# Altium schematic sheet PonyProgFT.SchDoc: USB - Power - I/O
size A3; Author: Claudio Lanconelli; CompanyName: Eurek srl; DrawnBy: Claudio Lanconelli; Organization: Eurek srl; DocumentNumber: 1; SheetNumber: 1; SheetTotal: 1
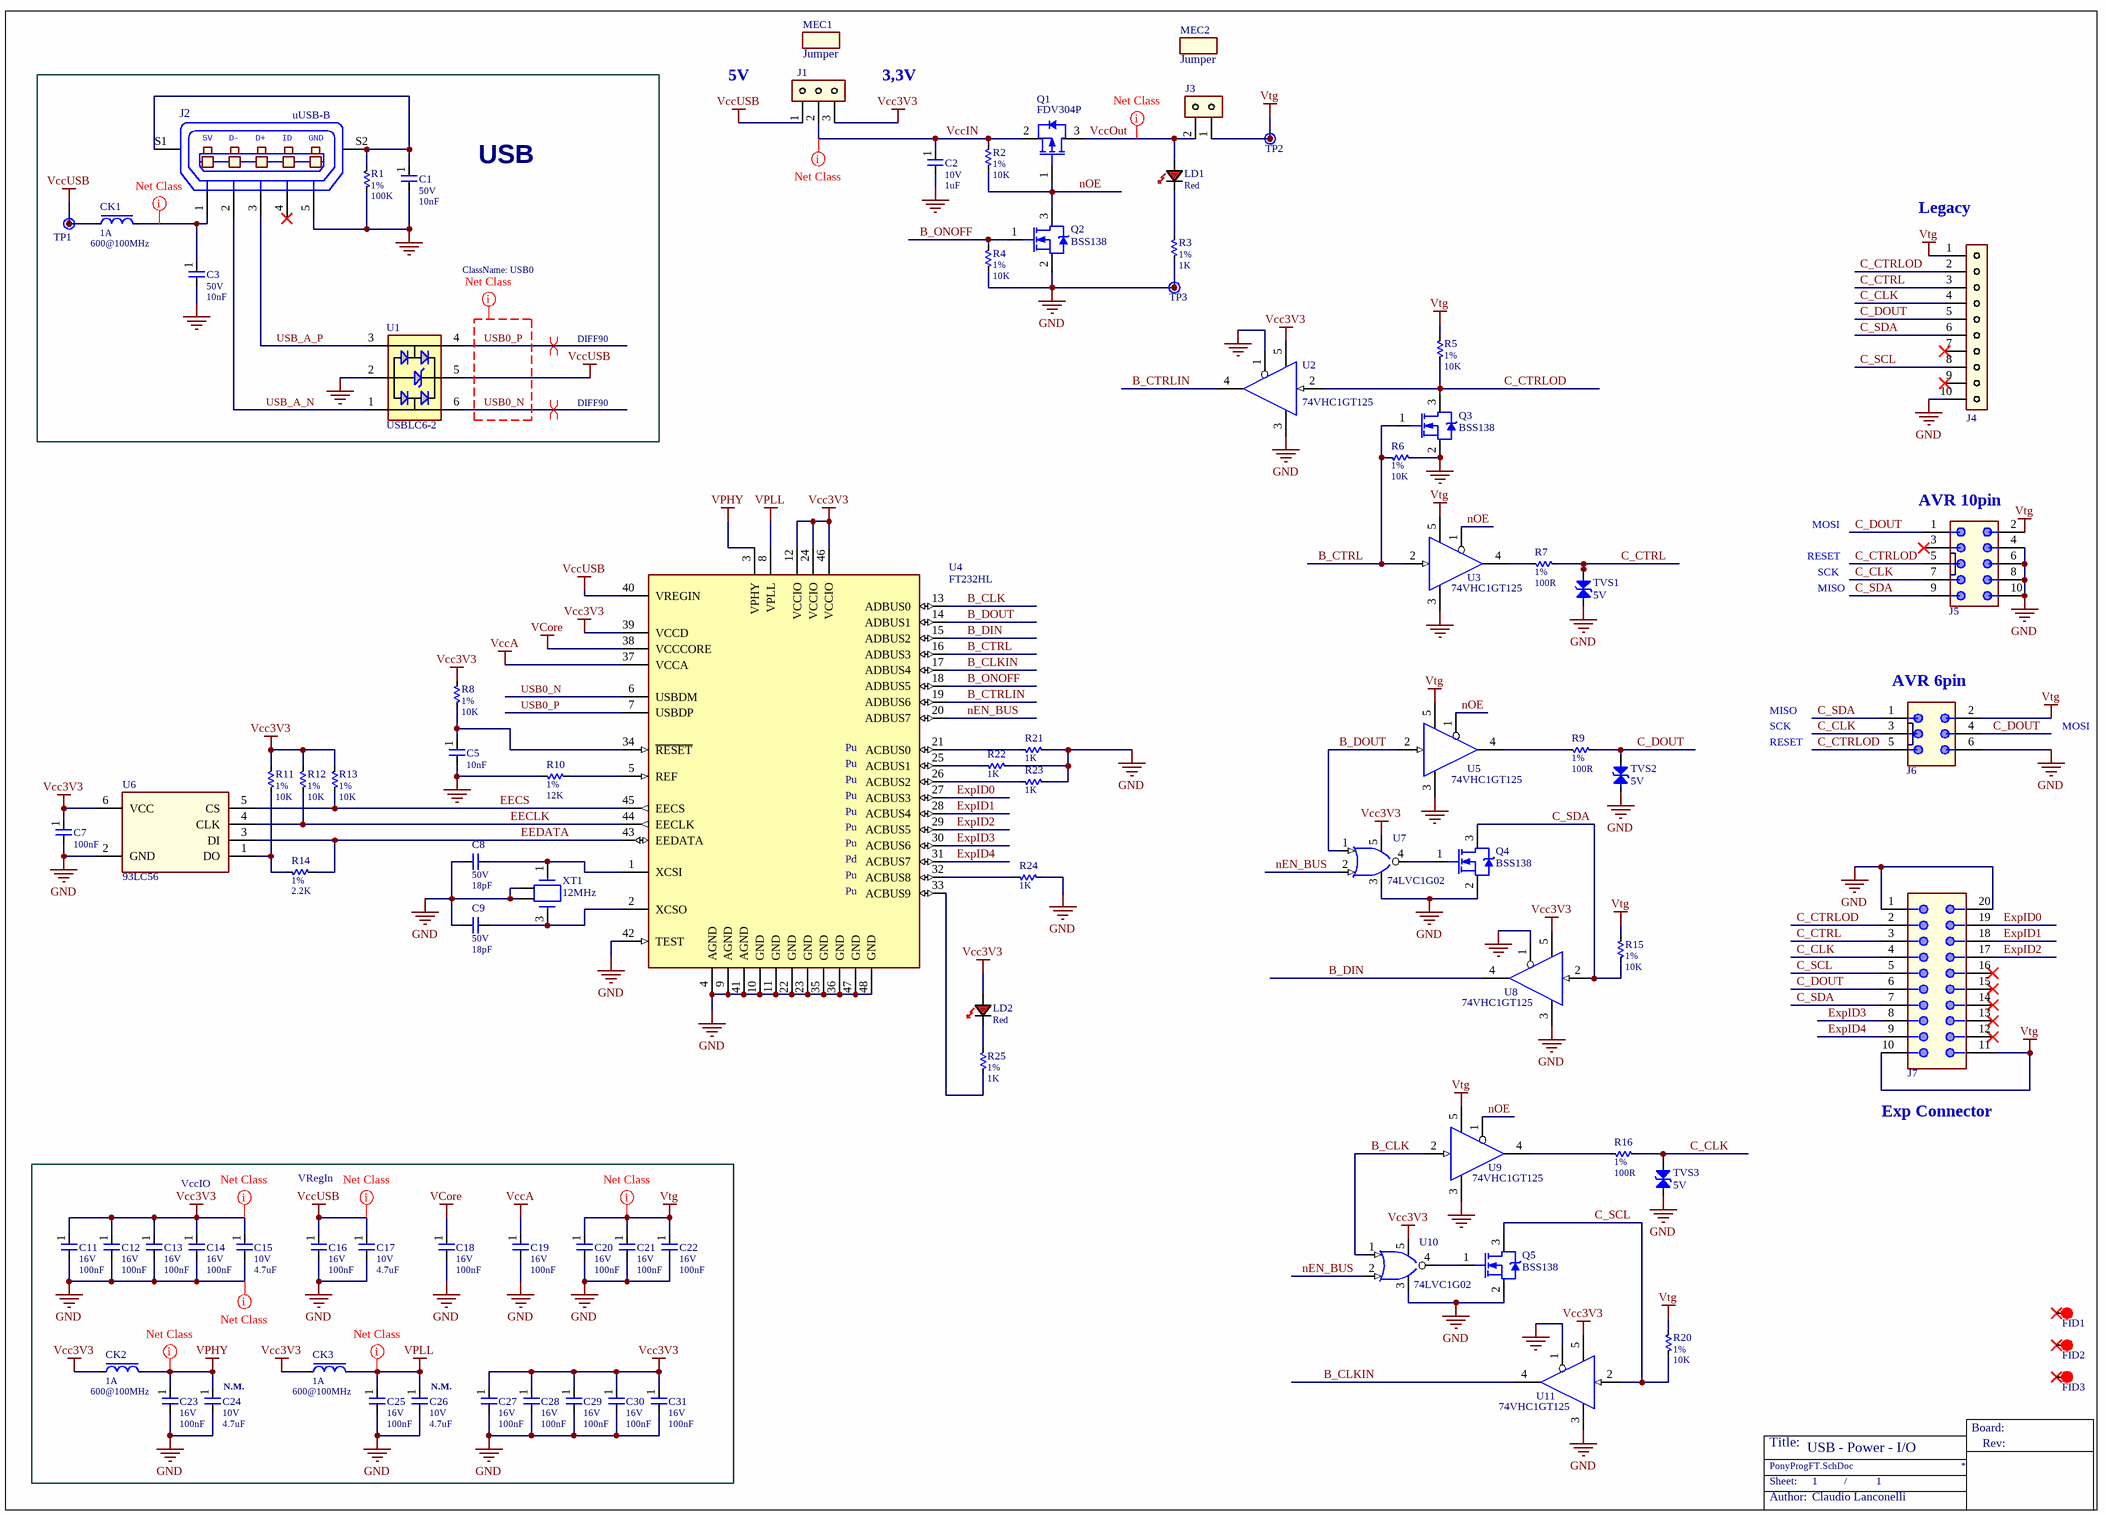
[diagram p0: PonyProgFT.SchDoc]

## Parts
C1  value 10nF  Voltage: 50V  [C0805_M]  (hidden comment: 10nF/50V/0805/10%)
C2  value 1uF  Voltage: 10V  [C0603_M]  (hidden comment: 1uF/10V/0603/10%)
C3  value 10nF  Voltage: 50V  [C0805_M]  (hidden comment: 10nF/50V/0805/10%)
C5  value 10nF  [C0402_H]  (hidden comment: 10nF/25V/0402/10%)
C7  value 100nF  [C0402_H]  (hidden comment: 100nF/16V/0402/10%)
C8  value 18pF  Voltage: 50V  [C0603_M]  (hidden comment: 18pF/50V/0603/5%)
C9  value 18pF  Voltage: 50V  [C0603_M]  (hidden comment: 18pF/50V/0603/5%)
C11  value 100nF  Voltage: 16V  [C0402_H]  (hidden comment: 100nF/16V/0402/10%)
C12  value 100nF  Voltage: 16V  [C0402_H]  (hidden comment: 100nF/16V/0402/10%)
C13  value 100nF  Voltage: 16V  [C0402_H]  (hidden comment: 100nF/16V/0402/10%)
C14  value 100nF  Voltage: 16V  [C0402_H]  (hidden comment: 100nF/16V/0402/10%)
C15  value 4.7uF  Voltage: 10V  [C0603_H]  (hidden comment: 4.7uF/10V/0603/10%)
C16  value 100nF  Voltage: 16V  [C0402_H]  (hidden comment: 100nF/16V/0402/10%)
C17  value 4.7uF  Voltage: 10V  [C0603_H]  (hidden comment: 4.7uF/10V/0603/10%)
C18  value 100nF  Voltage: 16V  [C0402_H]  (hidden comment: 100nF/16V/0402/10%)
C19  value 100nF  Voltage: 16V  [C0402_H]  (hidden comment: 100nF/16V/0402/10%)
C20  value 100nF  Voltage: 16V  [C0402_H]  (hidden comment: 100nF/16V/0402/10%)
C21  value 100nF  Voltage: 16V  [C0402_H]  (hidden comment: 100nF/16V/0402/10%)
C22  value 100nF  Voltage: 16V  [C0402_H]  (hidden comment: 100nF/16V/0402/10%)
C23  value 100nF  Voltage: 16V  [C0402_H]  (hidden comment: 100nF/16V/0402/10%)
C24  value 4.7uF  Populated: N.M.  Voltage: 10V  [C0603_H]  (hidden comment: 4.7uF/10V/0603/10%)
C25  value 100nF  Voltage: 16V  [C0402_H]  (hidden comment: 100nF/16V/0402/10%)
C26  value 4.7uF  Populated: N.M.  Voltage: 10V  [C0603_H]  (hidden comment: 4.7uF/10V/0603/10%)
C27  value 100nF  Voltage: 16V  [C0402_H]  (hidden comment: 100nF/16V/0402/10%)
C28  value 100nF  Voltage: 16V  [C0402_H]  (hidden comment: 100nF/16V/0402/10%)
C29  value 100nF  Voltage: 16V  [C0402_H]  (hidden comment: 100nF/16V/0402/10%)
C30  value 100nF  Voltage: 16V  [C0402_H]  (hidden comment: 100nF/16V/0402/10%)
C31  value 100nF  Voltage: 16V  [C0402_H]  (hidden comment: 100nF/16V/0402/10%)
CK1  value 600@100MHz  RatedCurrent: 1A  [C0603_M]  (hidden comment: 600@100MHz/1A/0603)
CK2  value 600@100MHz  RatedCurrent: 1A  [C0603_M]  (hidden comment: 600@100MHz/1A/0603)
CK3  value 600@100MHz  RatedCurrent: 1A  [C0603_M]  (hidden comment: 600@100MHz/1A/0603)
FID1  Fiducial  [FID_1MM]  (value not drawn)
FID2  Fiducial  [FID_1MM]  (value not drawn)
FID3  Fiducial  [FID_1MM]  (value not drawn)
J1  61300311121  [CON_WE_61300311121]  (value not drawn)
J2  Type: uUSB-B  [CON_FCI_10118192]  (hidden comment: 10118192-0001LF)
J3  61300211121  [CON_WE_61300211121]  (value not drawn)
J4  75915-310LF  [CON_FCI_75915-310LF]  (value not drawn)
J5  61201021621  [CON_WE_61201021621]  (value not drawn)
J6  61200621621  [CON_WE_61200621621]  (value not drawn)
J7  10056847-101LF  [CON_FCI_10056847-101LF]  (value not drawn)
LD1  Red  [LED_WL-SMCW_1206]
LD2  Red  [LED_WL-SMCW_1206]
MEC1  Jumper  (mechanical)
MEC2  Jumper  (mechanical)
Q1  FDV304P  [SOT23-3_H]
Q2  BSS138  [SOT23-3_H]
Q3  BSS138  [SOT23-3_H]
Q4  BSS138  [SOT23-3_H]
Q5  BSS138  [SOT23-3_H]
R1  value 100K  Tolerance: 1%  [C0603_M]  (hidden comment: 100K/1%/0603)
R2  value 10K  Tolerance: 1%  [C0603_M]  (hidden comment: 10K/1%/0603)
R3  value 1K  Tolerance: 1%  [C0603_M]  (hidden comment: 1K/1%/0603)
R4  value 10K  Tolerance: 1%  [C0603_M]  (hidden comment: 10K/1%/0603)
R5  value 10K  Tolerance: 1%  [C0603_M]  (hidden comment: 10K/1%/0603)
R6  value 10K  Tolerance: 1%  [C0603_M]  (hidden comment: 10K/1%/0603)
R7  value 100R  Tolerance: 1%  [C0603_M]  (hidden comment: 100R/1%/0603)
R8  value 10K  Tolerance: 1%  [C0603_M]  (hidden comment: 10K/1%/0603)
R9  value 100R  Tolerance: 1%  [C0603_M]  (hidden comment: 100R/1%/0603)
R10  value 12K  Tolerance: 1%  [C0603_M]  (hidden comment: 12K/1%/0603)
R11  value 10K  Tolerance: 1%  [C0603_M]  (hidden comment: 10K/1%/0603)
R12  value 10K  Tolerance: 1%  [C0603_M]  (hidden comment: 10K/1%/0603)
R13  value 10K  Tolerance: 1%  [C0603_M]  (hidden comment: 10K/1%/0603)
R14  value 2.2K  Tolerance: 1%  [C0402_H]  (hidden comment: 2.2K/1%/0402)
R15  value 10K  Tolerance: 1%  [C0603_M]  (hidden comment: 10K/1%/0603)
R16  value 100R  Tolerance: 1%  [C0603_M]  (hidden comment: 100R/1%/0603)
R20  value 10K  Tolerance: 1%  [C0603_M]  (hidden comment: 10K/1%/0603)
R21  value 1K  [C0603_M]  (hidden comment: 1K/1%/0603)
R22  value 1K  [C0603_M]  (hidden comment: 1K/1%/0603)
R23  value 1K  [C0603_M]  (hidden comment: 1K/1%/0603)
R24  value 1K  [C0603_M]  (hidden comment: 1K/1%/0603)
R25  value 1K  Tolerance: 1%  [C0603_M]  (hidden comment: 1K/1%/0603)
TP1  non montare  [TP-1MM]  (value not drawn)  (no BOM)
TP2  non montare  [TP-1MM]  (value not drawn)  (no BOM)
TP3  non montare  [TP-1MM]  (value not drawn)  (no BOM)
TVS1  Voltage: 5V  [C0603_M]  (hidden comment: 82356050560)
TVS2  Voltage: 5V  [C0603_M]  (hidden comment: 82356050560)
TVS3  Voltage: 5V  [C0603_M]  (hidden comment: 82356050560)
U1  Series: USBLC6-2  [SOT-666_M]  (hidden comment: USBLC6-2P6)
U2  Serie: 74VHC1GT125  [TSOP5-ON]  (hidden comment: M74VHC1GT125DT1G)
U3  Serie: 74VHC1GT125  [TSOP5-ON]  (hidden comment: M74VHC1GT125DT1G)
U4  FT232HL  [LQFP48_P50_M-STM]
U5  Serie: 74VHC1GT125  [TSOP5-ON]  (hidden comment: M74VHC1GT125DT1G)
U6  Serie: 93LC56  [SOT23-6_M]  (hidden comment: 93LC56BT-I/OT)
U7  value 74LVC1G02  [SOT23-5_M]  (hidden comment: 74LVC1G02GV,125)
U8  Serie: 74VHC1GT125  [TSOP5-ON]  (hidden comment: M74VHC1GT125DT1G)
U9  Serie: 74VHC1GT125  [TSOP5-ON]  (hidden comment: M74VHC1GT125DT1G)
U10  value 74LVC1G02  [SOT23-5_M]  (hidden comment: 74LVC1G02GV,125)
U11  Serie: 74VHC1GT125  [TSOP5-ON]  (hidden comment: M74VHC1GT125DT1G)
XT1  value 12MHz  [XTAL-NX3225SA]

## Blocks framed on the sheet
USB: C1 C3 CK1 J2 R1 TP1 U1

## Nets
GND: C1.2 C2.2 C3.2 C5.2 C7.2 C8.1 C9.1 C11.2 C12.2 C13.2 C14.2 C15.2 C16.2 C17.2 C18.2 C19.2 C20.2 C21.2 C22.2 C23.2 C24.2 C25.2 C26.2 C27.2 C28.2 C29.2 C30.2 C31.2 J2.5(P5) J4.10 J5.4 J5.6 J5.8 J5.10 J6.6 J7.1 J7.20 Q2.2(S) Q3.2(S) Q4.2(S) Q5.2(S) R1.2 R3.2 R4.2 R6.2 R10.1 R21.1 R22.1 R23.1 R24.1 TP3.1(TP) TVS1.1 TVS2.1 TVS3.1 U1.2 U2.1(~{OE}) U2.3(GND) U3.3(GND) U4.4(AGND) U4.9(AGND) U4.10(GND) U4.11(GND) U4.22(GND) U4.23(GND) U4.35(GND) U4.36(GND) U4.41(AGND) U4.42(TEST) U4.47(GND) U4.48(GND) U5.3(GND) U6.2(GND) U7.3(GND) U8.1(~{OE}) U8.3(GND) U9.3(GND) U10.3(GND) U11.1(~{OE}) U11.3(GND) XT1.2(GND) XT1.4(GND)
Vcc3V3: C7.1 C11.1 C12.1 C13.1 C14.1 C15.1 C27.1 C28.1 C29.1 C30.1 C31.1 CK2.1 CK3.1 J1.3 LD2.A(Anode) R8.2 R11.1 R12.1 R13.1 U2.5(VCC) U4.12(VCCIO) U4.24(VCCIO) U4.39(VCCD) U4.46(VCCIO) U6.6(VCC) U7.5(VCC) U8.5(VCC) U10.5(VCC) U11.5(VCC)
VccA: C19.1 U4.37(VCCA)
VccUSB: C16.1 C17.1 CK1.1 J1.1 TP1.1(TP) U1.5 U4.40(VREGIN)
VCore: C18.1 U4.38(VCCCORE)
VPHY: C23.1 C24.1 CK2.2 U4.3(VPHY)
VPLL: C25.1 C26.1 CK3.2 U4.8(VPLL)
Vtg: C20.1 C21.1 C22.1 J3.1 J4.1 J5.2 J6.2 J7.10 J7.11 R5.1 R15.2 R20.1 TP2.1(TP) U3.5(VCC) U5.5(VCC) U9.5(VCC)
B_CLK: U4.13(ADBUS0) U9.2(A) U10.1(A)
B_CLKIN: U4.17(ADBUS4) U11.4(Y)
B_CTRL: Q3.1(G) R6.1 U3.2(A) U4.16(ADBUS3)
B_CTRLIN: U2.4(Y) U4.19(ADBUS6)
B_DIN: U4.15(ADBUS2) U8.4(Y)
B_DOUT: U4.14(ADBUS1) U5.2(A) U7.1(A)
B_ONOFF: Q2.1(G) R4.1 U4.18(ADBUS5)
C_CLK: J4.4 J5.7 J6.3 J7.4 R16.2 TVS3.2
C_CTRL: J4.3 J7.3 R7.2 TVS1.2
C_CTRLOD: J4.2 J5.5 J6.5 J7.2 Q3.3(D) R5.2 U2.2(A)
C_DOUT: J4.5 J5.1 J6.4 J7.6 R9.2 TVS2.2
C_SCL: J4.8 J7.5 Q5.3(D) R20.2 U11.2(A)
C_SDA: J4.6 J5.9 J6.1 J7.7 Q4.3(D) R15.1 U8.2(A)
EECLK: R12.2 U4.44(EECLK) U6.4(CLK)
EECS: R13.2 U4.45(EECS) U6.5(CS)
EEDATA: R14.2 U4.43(EEDATA) U6.3(DI)
ExpID0: J7.19 U4.27(ACBUS3)
ExpID1: J7.18 U4.28(ACBUS4)
ExpID2: J7.17 U4.29(ACBUS5)
ExpID3: J7.8 U4.30(ACBUS6)
ExpID4: J7.9 U4.31(ACBUS7)
nEN_BUS: U4.20(ADBUS7) U7.2(B) U10.2(B)
nOE: Q1.1(G) Q2.3(D) R2.2 U3.1(~{OE}) U5.1(~{OE}) U9.1(~{OE})
USB0_N: U1.6 U4.6(USBDM)
USB0_P: U1.4 U4.7(USBDP)
USB_A_N: J2.2(P2) U1.1
USB_A_P: J2.3(P3) U1.3
VccIN: C2.1 J1.2 Q1.2(S) R2.1
VccOut: J3.2 LD1.A(Anode) Q1.3(D)
NetC1_1: C1.1 J2.S1(Shell1) J2.S2(Shell2) R1.1
NetC3_1: C3.1 CK1.2 J2.1(P1)
NetC5_1: C5.1 R8.1 U4.34(~{RESET})
NetC8_2: C8.2 U4.1(XCSI) XT1.1
NetC9_2: C9.2 U4.2(XCSO) XT1.3
NetLD1_K: LD1.K(Cathode) R3.1
NetLD2_K: LD2.K(Cathode) R25.2
NetQ4_1: Q4.1(G) U7.4(Y)
NetQ5_1: Q5.1(G) U10.4(Y)
NetR7_1: R7.1 U3.4(Y)
NetR9_1: R9.1 U5.4(Y)
NetR10_2: R10.2 U4.5(REF)
NetR11_2: R11.2 R14.1 U6.1(DO)
NetR16_1: R16.1 U9.4(Y)
NetR21_2: R21.2 U4.21(ACBUS0)
NetR22_2: R22.2 U4.25(ACBUS1)
NetR23_2: R23.2 U4.26(ACBUS2)
NetR24_2: R24.2 U4.32(ACBUS8)
NetR25_1: R25.1 U4.33(ACBUS9)

Not connected (* = marked no-connect by the designer): FID1 1*; FID2 1*; FID3 1*; J2 4(P4)*; J4 7* 9*; J5 3*; J7 12* 13* 14* 15* 16*

## Layout directives
differential pair; net class DIFF90: USB0_N, USB0_P
net class USB0: USB0_N, USB0_P
net class NETPWR: GND, NetC3_1, Vcc3V3, VccIN, VccOut, VccUSB, VPHY, VPLL, Vtg

## Notes on the sheet
- 5V
- 3,3V
- (near J4) Legacy
- (near J5) AVR 10pin
- RESET
- MOSI
- SCK
- MISO
- (near J6) AVR 6pin
- (near U4) Pu
- (near U4) Pd
- (near J7) Exp Connector
- VccIO
- VRegIn
- Title:
- Board:
- Rev:
- Author:
- Sheet:
- /
- (in symbol CON_FCI_10118192-0001LF) 5V; D-; D+; ID; GND

## Library data of the parts
C1 C3 = CX7R10N50V10%0805_CL: Chip Ceramic Capacitor X7R 0805 10nF 50V 10%; Manufacturer: Samsung Electro-Mechanics; Sep: /; Prefix: CX7R; Man_PN: CL21B103KBCNNNC; TemperatureRange: -55°C ~ 125°C; Tmp: 10nF/50V/0805/10%; Tolerance: 10%; Package: 0805; Mounting Type: SMD; Supplier 1: Digi-Key; Supplier Part Number 1: 1276-1078-1-ND; Category: Capacitors; Stock 1: 40000; Pricing 1: 1=0.08, 10=0.039, 100=0.0174, 500=0.01244, 1000=0.00978 (EUR); Temperature Coefficient: X7R; ComponentLink1URL: http://www.samsungsem.com/kr/support/product-search/mlcc/CL21B103KBCNNNC.jsp; ComponentLink1Description: http://www.samsungsem.com/kr/support/product-search/mlcc/CL21B103KBCNNNC.jsp
C2 = CX5R1U10V10%0603_GRM: Chip Ceramic Capacitor X5R 0603 1uF 10V 10%; Manufacturer: Murata Electronics North America; Sep: /; Prefix: CX5R; Man_PN: GRM188R61A105KA61D; TemperatureRange: -55 to +85 C; Brand: Murata Electronics; Tmp: 1uF/10V/0603/10%; Tolerance: 10%; Package: 0603; Supplier 1: Digi-Key; Category: Capacitors; Stock 1: 1341589; Pricing 1: 1=0.18, 10=0.076, 50=0.0412, 100=0.0349, 250=0.02852, 500=0.02442, 1000=0.01904 (EUR); Mounting Type: Surface Mount, MLCC; ComponentLink1URL: http://www.murata.com/~/media/webrenewal/support/library/catalog/products/capacitor/mlcc/c02e.ashx; ComponentLink1Description: http://www.murata.com/~/media/webrenewal/support/library/catalog/products/capacitor/mlcc/c02e.ashx; Supplier 2: Farnell; Stock 2: 15519; Pricing 2: 10=0,0412, 100=0,0358, 500=0,0234, 1000=0,02, 2000=0,0174, 4000=0,0139, 20000=0,0109, 40000=0,0099 (EUR); ComponentLink2URL: http://www.farnell.com/datasheets/608985.pdf; ComponentLink2Description: http://www.farnell.com/datasheets/608985.pdf; Supplier 3: Mouser; Stock 3: 217680; Pricing 3: 1=0.328, 10=0.041, 100=0.025, 1000=0.019, 4000=0.016, 8000=0.013, 24000=0.012, 48000=0.011, 100000=0.009 (EUR); Product: General Type MLCCs; Series: GRM; Standard Pack Qty: 4000; ComponentLink3URL: http://www.mouser.com/ds/2/281/c02e-2905.pdf; ComponentLink3Description: http://www.mouser.com/ds/2/281/c02e-2905.pdf; Supplier Part Number 1: 490-1543-1-ND; Supplier Part Number 2: 1828798RL; Supplier Part Number 3: 81-GRM39R105K10
C5 = CX7R10N25V10%0402_GRM: Chip Ceramic Capacitor X7R 0402 10nF 25V 10%; Manufacturer: Murata Electronics North America; Sep: /; Prefix: CX7R; Man_PN: GRM155R71E103KA01D; TemperatureRange: - 55 C to + 125 C; Brand: Murata Electronics; Tmp: 10nF/25V/0402/10%; Tolerance: 10%; Package: 0402; Supplier 1: Digi-Key; Category: Capacitors; Stock 1: 5245585; Pricing 1: 1=0.18, 10=0.023, 50=0.0124, 100=0.0107, 250=0.00876, 500=0.00748, 1000=0.00583, 5000=0.00486 (EUR); Temperature Coefficient: X7R; Mounting Type: Surface Mount, MLCC; ComponentLink1URL: http://www.murata.com/~/media/webrenewal/support/library/catalog/products/capacitor/mlcc/c02e.ashx; ComponentLink1Description: http://www.murata.com/~/media/webrenewal/support/library/catalog/products/capacitor/mlcc/c02e.ashx; Supplier 2: Farnell; Stock 2: 53881; Pricing 2: 10=0,0079, 100=0,0068, 500=0,0057, 2500=0,0045, 5000=0,0042, 10000=0,0038, 50000=0,0027, 100000=0,0022 (EUR); ComponentLink2URL: http://www.farnell.com/datasheets/313472.pdf; ComponentLink2Description: http://www.farnell.com/datasheets/313472.pdf; ComponentLink3URL: http://www.farnell.com/datasheets/1747448.pdf; ComponentLink3Description: http://www.farnell.com/datasheets/1747448.pdf; Supplier 3: Mouser; Stock 3: 1716897; Pricing 3: 1=0.102, 10=0.007, 100=0.004, 1000=0.003, 10000=0.003, 20000=0.002 (EUR); Product: General Type MLCCs; Series: GRM; Standard Pack Qty: 10000; Supplier Part Number 1: 490-1312-1-ND; Supplier Part Number 2: 8819734; Supplier Part Number 3: 81-GRM36X103K25; Voltage: 25V
C7 C11-C14 C16 C18-C23 C25 C27-C31 = CX7R100N16V10%0402_GRM: Chip Ceramic Capacitor X7R 0402 100nF 16V 10%; Manufacturer: Murata Electronics North America; Sep: /; Prefix: CX7R; Man_PN: GRM155R71C104KA88D; Capacitance: 0.1µF; TemperatureRange: -55°C ~ 125°C; Serie: GRM; Tmp: 100nF/16V/0402/10%; Tolerance: 10%; CType: X7R; Package: 0402; Supplier 1: Digi-Key; RoHS: RoHS Compliant; Category: Capacitors; Stock 1: 20605595; Pricing 1: 1=0.18, 10=0.027, 50=0.0148, 100=0.0124, 250=0.01016, 500=0.00868, 1000=0.00676, 5000=0.00563 (EUR); Packaging: Cut Tape (CT); Temperature Coefficient: X7R; Mounting Type: Surface Mount, MLCC; Applications: General Purpose; Size / Dimension: 0.039" L x 0.020" W (1.00mm x 0.50mm); Thickness (Max): 0.022" (0.55mm); ComponentLink1URL: http://www.murata.com/~/media/webrenewal/support/library/catalog/products/capacitor/mlcc/c02e.ashx; ComponentLink1Description: http://www.murata.com/~/media/webrenewal/support/library/catalog/products/capacitor/mlcc/c02e.ashx; Supplier 2: Farnell; Stock 2: 268794; Pricing 2: 10=0,0121, 100=0,0113, 500=0,0105, 2500=0,0069, 5000=0,0059, 10000=0,0051, 50000=0,0034, 100000=0,0029 (EUR); ComponentLink2URL: http://www.farnell.com/datasheets/313472.pdf; ComponentLink2Description: http://www.farnell.com/datasheets/313472.pdf; ComponentLink3URL: http://www.farnell.com/datasheets/1747446.pdf; ComponentLink3Description: http://www.farnell.com/datasheets/1747446.pdf; ComponentLink4URL: http://www.farnell.com/cad/1547289.zip; ComponentLink4Description: http://www.farnell.com/cad/1547289.zip; Supplier Part Number 1: 490-3261-1-ND; Supplier Part Number 2: 8819742; RatedVoltage: 16V
  C7: Voltage: 16V
C8 C9 = CCOG18P50V5%0603_KEMET: Chip Ceramic Capacitor C0G 0603 18pF 50V 5%; Manufacturer: Kemet; Sep: /; Prefix: CCOG; TemperatureRange: -55°C ~ 125°C; Man_PN: C0603C180J5GACTU; Tmp: 18pF/50V/0603/5%; Tolerance: 5%; Package: 0603; Supplier 1: Digi-Key; Supplier Part Number 1: 399-1052-1-ND
C15 C17 C24 C26 = CX5R4.7U10V10%0603_TDK: Chip Ceramic Capacitor X5R 0603 4.7uF 10V 10%; Manufacturer: TDK Corporation; Sep: /; Prefix: CX5R; Man_PN: CGB3B1X5R1A475K055AC; Capacitance: 4.7µF; TemperatureRange: -55 to 85°C; Gamma Prodotti: Serie CGB; Imballaggio: Nastro; Tmp: 4.7uF/10V/0603/10%; Tolerance: 10%; CType: X5R; Package: 0603; Supplier 1: Digi-Key; RoHS: RoHS Compliant; Category: Capacitors; Stock 1: 100245; Pricing 1: 1=0.25, 10=0.205, 100=0.1024, 250=0.07676, 500=0.06782, 1000=0.06014 (EUR); Packaging: Cut Tape (CT); RatedVoltage: 10V; Temperature Coefficient: X5R; Mounting Type: Surface Mount, MLCC; Applications: General Purpose; Size / Dimension: 0.063" L x 0.031" W (1.60mm x 0.80mm); Thickness (Max): 0.022" (0.55mm); Features: Low Profile; ComponentLink1URL: http://product.tdk.com/capacitor/mlcc/en/documents/mlcc_commercial_lowprofile_en.pdf; ComponentLink1Description: http://product.tdk.com/capacitor/mlcc/en/documents/mlcc_commercial_lowprofile_en.pdf; Supplier 2: Farnell; Stock 2: 1550; Pricing 2: 10=0,115, 100=0,066, 500=0,054, 1000=0,0382, 2000=0,0363, 4000=0,0344, 20000=0,0271, 40000=0,0266 (EUR); ComponentLink2URL: http://www.farnell.com/datasheets/1796654.pdf; ComponentLink2Description: http://www.farnell.com/datasheets/1796654.pdf; Supplier Part Number 1: 445-7482-1-ND; Supplier Part Number 2: 2346974
CK1-CK3 = FCB600Z1A0603MPZ: Ferrite Chip Beads SMD 0603 600@100MHz 1A; Manufacturer: TDK Corporation; Sep: /; Prefix: FCB; Man_PN: MPZ1608S601ATA00; TemperatureRange: - 55 C to + 125 C; Tolerance: 25 %; Brand: TDK; Package: 0603; Tmp: 600@100MHz/1A/0603; Supplier 1: Digi-Key; Supplier Part Number 1: 445-2205-1-ND; Category: Filters; Stock 1: 85976; Pricing 1: 1=0.1, 10=0.081, 100=0.0483, 250=0.03512, 500=0.0322, 1000=0.02781 (EUR); Mounting Type: Surface Mount; ComponentLink1URL: http://product.tdk.com/en/catalog/datasheets/beads_commercial_power_mpz_en.pdf; ComponentLink1Description: http://product.tdk.com/en/catalog/datasheets/beads_commercial_power_mpz_en.pdf; Supplier 2: Farnell; Supplier Part Number 2: 2393198; Stock 2: 1665; Pricing 2: 1=0,043 (EUR); ComponentLink2URL: http://www.farnell.com/datasheets/1795297.pdf; ComponentLink2Description: http://www.farnell.com/datasheets/1795297.pdf; Supplier 3: Mouser; Supplier Part Number 3: 810-MPZ1608S601ATA00; Stock 3: 77631; Pricing 3: 1=0.102, 10=0.081, 100=0.036, 500=0.033, 1000=0.029, 4000=0.021, 8000=0.019, 24000=0.017 (EUR); Product: Ferrite Chip Beads; Series: MPZ1608; ComponentLink3URL: http://product.tdk.com/emc/beads/detailed_information.php?lang=en&ref=jp&part_no=MPZ1608S601ATA00; ComponentLink3Description: http://product.tdk.com/emc/beads/detailed_information.php?lang=en&ref=jp&part_no=MPZ1608S601ATA00
FID1-FID3 = FID: Fiducial (non montare); Sep: /; Populated: N.M.; Prefix: FID
J1 = CON_WE_61300311121: THT Vertical Pin Header Male WR-PHD, Pitch 2.54 mm, Single Row, 3 pins; Manufacturer: WE; Sep: /; Prefix: CON; Voltage: 250VAC; TemperatureRange: -40 to 105 degC; RatedCurrent: 3A; Tmp: 61300311121; Value: 61300311121; Mounting Type: PTH; ComponentLink1URL: https://katalog.we-online.de/em/datasheet/6130xx11121.pdf; ComponentLink1Description: Datasheet; Man_PN: 61300311121; Serie: WR-PHD; Supplier 1: Digi-Key; Supplier Part Number 1: 732-5316-ND
J2 = CON_FCI_10118192-0001LF: Micro-USB Type-B, right-angle, horizontal receptacle; Manufacturer: FCI; Sep: /; Connector Type: USB - micro B; Number of Contacts: 5; USB Standard: USB 2.0; Livello di Corrente: 1; Resistenza Contatto: 40; Tensione Nominale V AC: 100; Tipo Terminazione Contatto: A Saldare; RatedCurrent: 1.8 A; Mounting Angle: Right; TemperatureRange: - 55 C to + 85 C; Insulation Resistance: 1000 MOhms; Tmp: 10118192-0001LF; Supplier 1: Digi-Key; Supplier Part Number 1: 609-4613-1-ND; Man_PN: 10118192-0001LF; RoHS: RoHS Compliant; Category: Connectors, Interconnects; Stock 1: 120847; Pricing 1: 1=0.4, 10=0.379, 25=0.3248, 50=0.2762, 100=0.2653, 250=0.2382, 500=0.22738 (EUR); Packaging: Cut Tape (CT); Gender: Receptacle; Mounting Type: Surface Mount, Right Angle, Horizontal; Features: Flange, Shielded; ComponentLink1URL: http://portal.fciconnect.com/Comergent//fci/drawing/10118192.pdf; ComponentLink1Description: http://portal.fciconnect.com/Comergent//fci/drawing/10118192.pdf; Supplier 2: Farnell; Supplier Part Number 2: 1568026; Stock 2: 25170; Pricing 2: 1=0.916, 10=0.804, 50=0.733, 100=0.649, 250=0.599, 500=0.55, 1000=0.47 (EUR); ComponentLink2URL: http://www.farnell.com/datasheets/1024588.pdf; ComponentLink2Description: http://www.farnell.com/datasheets/1024588.pdf; ComponentLink3URL: http://www.farnell.com/cad/1698067.pdf; ComponentLink3Description: http://www.farnell.com/cad/1698067.pdf; ComponentLink4URL: http://bcove.me/7u53lztr; ComponentLink4Description: http://bcove.me/7u53lztr; ComponentLink5URL: http://www.farnell.com/datasheets/1681853.pdf; ComponentLink5Description: http://www.farnell.com/datasheets/1681853.pdf; ComponentLink6URL: http://www.farnell.com/cad/1670194.zip; ComponentLink6Description: http://www.farnell.com/cad/1670194.zip; Supplier 3: Mouser; Supplier Part Number 3: 649-10118192-0001LF; Stock 3: 19393; Pricing 3: 1=0.429, 10=0.295, 100=0.254, 500=0.242, 1400=0.184, 2800=0.168, 4200=0.158, 9800=0.145 (EUR); Color: Black; Contact Plating: Gold; Product: Micro USB Type B Connectors; Termination Style: SMD; Brand: FCI; Contact Material: Copper Alloy; Flammability Rating: UL 94 V-0; Standard: USB 2.0; Standard Pack Qty: 1400; Minimum Order Quantity: 1; Reeling: True; ComponentLink7URL: http://www.mouser.com/ds/2/154/10118192AC-197249.pdf; ComponentLink7Description: http://www.mouser.com/ds/2/154/10118192AC-197249.pdf
J3 = CON_WE_61300211121: THT Vertical Pin Header Male WR-PHD, Pitch 2.54 mm, Single Row, 2 pins; Manufacturer: WE; Sep: /; Prefix: CON; Voltage: 250VAC; TemperatureRange: -40 to 105 degC; RatedCurrent: 3A; Tmp: 61300211121; Value: 61300211121; Mounting Type: PTH; ComponentLink1URL: https://katalog.we-online.de/em/datasheet/6130xx11121.pdf; ComponentLink1Description: Datasheet; Man_PN: 61300211121; Serie: WR-PHD; Supplier 1: Digi-Key; Supplier Part Number 1: 732-5315-ND
J4 = CON_FCI_75915-310LF: CONN RCPT 10POS 0.1 GOLD PCB; Manufacturer: FCI; Sep: /; Package: 10x2.54mm; Mounting Type: TPH; Man_PN: 75915-310LF
J5 = CON_WE_61201021621: Male Box Header WR-BHD, THT, Vertical, pitch 2.54 mm, 10 pins; Manufacturer: WE; Sep: /; Prefix: CON; Voltage: 250Vac; TemperatureRange: -40 to 125 degC; Tmp: 61201021621; Mounting Type: PTH; Man_PN: 61201021621; Supplier Part Number 1: 732-2094-ND; Supplier 1: Digi-Key; ComponentLink1Description: Datasheet; ComponentLink1URL: https://katalog.we-online.com/em/datasheet/6120xx21621.pdf
J6 = CON_WE_61200621621: Male Box Header WR-BHD, THT, Vertical, pitch 2.54 mm, 6 pins; Manufacturer: WE; Sep: /; Prefix: CON; Voltage: 250V; TemperatureRange: -40 to +125; RatedCurrent: 3 A; Tmp: 61200621621; Mounting Type: TPH; Man_PN: 61200621621; Supplier 1: Mouser; Supplier Part Number 1: 710-61200621621; Stock 1: 1792; Pricing 1: 1=0.410, 10=0.390, 50=0.360, 100=0.346 (EUR); Serie: WR-BHD; Standard Pack Qty: 360; ComponentLink1URL: https://katalog.we-online.com/em/datasheet/6120xx21621.pdf; ComponentLink1Description: Datasheet; Supplier 2: Digi-Key; Supplier Part Number 2: 732-5394-ND
J7 = CON_FCI_10056847-101LF: Connector edge dual female 20 pos, 0.8pitch; Manufacturer: Amphenol ICC (FCI); Sep: /; Prefix: CON; Tmp: 10056847-101LF; Mounting Type: SMD; Man_PN: 10056847-101LF; Supplier 1: Digi-Key; Supplier Part Number 1: 609-4943-1-ND
LD1 LD2 = LED_WE_150120RS75000: Chip LED SMD WL-SMCW, size 1206, Red, 2V, 140 deg, 150 mcd; Manufacturer: Wurth Electronics Inc.; Sep: /; Prefix: CLED; TemperatureRange: -40 up to +85 °C; Package: 1206; Tmp: Red; Supplier 1: Digi-Key; Supplier Part Number 1: 732-4991-1-ND; Man_PN: 150120RS75000; Category: Optoelectronics; Stock 1: 18723; Pricing 1: 1=0.18, 50=0.1718, 100=0.1471, 500=0.12602 (EUR); Voltage: 2V; ComponentLink1URL: https://katalog.we-online.de/led/datasheet/150120RS75000.pdf; ComponentLink1Description: Datasheet; Mounting Type: SMD; Serie: WL-SMCW; Value: Red
MEC1 MEC2 = MEC___: Jumper with pullback, 2.54mm pitch, black; Manufacturer: WE; Tmp: 609002115121; Sep: /; Prefix: MEC; Serie: WR-PHD; RatedCurrent: 3A; Man_PN: 609002115121; Supplier 1: Digi-Key; Supplier Part Number 1: 732-13618-ND
Q1 = IC_FDV304P: IC MOSFET P-CH 25V 460mA SOT-23; Manufacturer: On Semiconductor; Sep: /; TemperatureRange: -55°C ~ 150°C (TJ); Tmp: FDV304P; Prefix: IC; Mounting Type: SMD; Package: SOT23-3; Man_PN: FDV304P; Supplier 1: Digi-Key; Supplier Part Number 1: FDV304PCT-ND
Q2-Q5 = IC_BSS138: MOSFET N-CH 50V 0.22A SOT-23; Manufacturer: Fairchild Semiconductor; Sep: /; Prefix: IC; RatedCurrent: 220mA; Rated_Power: 360mW; TemperatureRange: - 55 C to 150 C; Tmp: BSS138; Supplier 1: Digi-Key; Supplier Part Number 1: BSS138DKR-ND; Man_PN: BSS138; Stock 1: 478163; Pricing 1: 1=0.2, 10=0.181, 25=0.1304, 100=0.1016, 250=0.0638, 500=0.05438, 1000=0.03705 (EUR); Package: TO-236-3, SC-59, SOT-23-3; Supplier Device Package: SOT-23; ComponentLink1URL: http://www.fairchildsemi.com/datasheets/BS/BSS138.pdf; ComponentLink1Description: http://www.fairchildsemi.com/datasheets/BS/BSS138.pdf; Supplier 2: Farnell; Supplier Part Number 2: 9845330; Stock 2: 124032; Pricing 2: 5=0.152, 50=0.065, 250=0.0623, 500=0.0366, 1500=0.02 (EUR); ComponentLink2URL: http://www.farnell.com/datasheets/193736.pdf; ComponentLink2Description: http://www.farnell.com/datasheets/193736.pdf; ComponentLink3URL: http://www.farnell.com/datasheets/410597.pdf; ComponentLink3Description: http://www.farnell.com/datasheets/410597.pdf; Supplier 3: Mouser; Supplier Part Number 3: 512-BSS138; Stock 3: 122160; Pricing 3: 1=0.201, 10=0.136, 100=0.057, 1000=0.034, 3000=0.029, 9000=0.025, 24000=0.024, 45000=0.022, 99000=0.019 (EUR); Brand: Fairchild Semiconductor; Standard Pack Qty: 3000; Voltage: 50V; Serie: BSS138
R1 = CRES100K1%100P0603T_CRCW: Chip Resistor 0603 100K 1% 100ppm; Manufacturer: Vishay Dale; Sep: /; Prefix: CRES; Watt: 1/10; ppm: 100; Voltage: 75V; Man_PN: CRCW0603100KFKEA; Temperature Coefficient: ±100ppm/°C; TemperatureRange: -55°C ~ 155°C; Tmp: 100K/1%/0603; Package: 0603; Supplier 1: Digi-Key; Category: Resistors; Stock 1: 980831; Pricing 1: 10=0.083, 50=0.0446, 200=0.0257, 1000=0.01751 (EUR); Supplier Device Package: 0603 (1608 Metric); Height: 0.020" (0.50mm); ComponentLink1URL: http://www.vishay.com/docs/20035/dcrcwe3.pdf; ComponentLink1Description: http://www.vishay.com/docs/20035/dcrcwe3.pdf; Supplier 2: Farnell; Stock 2: 5121; Pricing 2: 1=0,006, 10=0,003, 100=0,003, 1000=0,003, 5000=0,003, 30000=0,003 (EUR); RatedPower: 100; ComponentLink2URL: http://www.farnell.com/datasheets/66915.pdf; ComponentLink2Description: http://www.farnell.com/datasheets/66915.pdf; Supplier Part Number 1: 541-100KHCT-ND; Supplier Part Number 2: 1344361
R2 R4-R6 R8 R11-R13 R15 R20 = CRES10K1%100P0603T_CRCW: Chip Resistor 0603 10K 1% 100ppm; Manufacturer: Vishay Dale; Sep: /; Prefix: CRES; Watt: 1/10; ppm: 100; Voltage: 75V; Man_PN: CRCW060310K0FKEA; Temperature Coefficient: ±100ppm/°C; TemperatureRange: -55°C ~ 155°C; TemperatureRange: - 55 C to + 155 C; RatedPower: 100 mW; Brand: Vishay / Dale; Tmp: 10K/1%/0603; Package: 0603; Supplier 1: Digi-Key; Category: Resistors; Stock 1: 1364424; Pricing 1: 10=0.083, 50=0.0446, 200=0.0257, 1000=0.01751 (EUR); Supplier Device Package: 0603 (1608 Metric); Height: 0.020" (0.50mm); ComponentLink1URL: http://www.vishay.com/docs/20035/dcrcwe3.pdf; ComponentLink1Description: http://www.vishay.com/docs/20035/dcrcwe3.pdf; Supplier 2: Farnell; Stock 2: 121370; Pricing 2: 10=0,012, 100=0,0113, 500=0,0105, 1000=0,0067, 2500=0,0033 (EUR); ComponentLink2URL: http://www.farnell.com/datasheets/1720486.pdf; ComponentLink2Description: http://www.farnell.com/datasheets/1720486.pdf; ComponentLink3URL: http://www.farnell.com/cad/1551982.zip; ComponentLink3Description: http://www.farnell.com/cad/1551982.zip; Supplier 3: Mouser; Stock 3: 1710528; Pricing 3: 1=0.082, 10=0.013, 100=0.010, 1000=0.008, 5000=0.005, 25000=0.004, 50000=0.003 (EUR); Product: Thick Film Resistors SMD; Series: CRCW; Standard Pack Qty: 5000; Supplier Part Number 1: 541-10.0KHCT-ND; Supplier Part Number 2: 1469748; Supplier Part Number 3: 71-CRCW0603-10K-E3
R3 R21-R25 = CRES1K1%100P0603T_CRCW: Chip Resistor 0603 1K 1% 100ppm; Manufacturer: Vishay Dale; Sep: /; Prefix: CRES; Watt: 1/10; ppm: 100; Voltage: 75V; Man_PN: CRCW06031K00FKEA; Temperature Coefficient: ±100ppm/°C; TemperatureRange: -55°C ~ 155°C; RatedPower: 100 mW; Brand: Vishay / Dale; Tmp: 1K/1%/0603; Package: 0603; Supplier 1: Digi-Key; Supplier Part Number 1: 541-1.00KHDKR-ND; Category: Resistors; Stock 1: 1756590; Pricing 1: 10=0.071, 50=0.0382, 200=0.02195, 1000=0.01497 (EUR); Supplier Device Package: 0603 (1608 Metric); Height: 0.020" (0.50mm); ComponentLink1URL: http://www.vishay.com/docs/20035/dcrcwe3.pdf; ComponentLink1Description: http://www.vishay.com/docs/20035/dcrcwe3.pdf; Supplier 2: Farnell; Supplier Part Number 2: 1469740; Stock 2: 93161; Pricing 2: 10=0.018, 100=0.0134, 500=0.0112, 1000=0.0092, 2500=0.0035 (EUR); ComponentLink2URL: http://www.farnell.com/datasheets/1720486.pdf; ComponentLink2Description: http://www.farnell.com/datasheets/1720486.pdf; ComponentLink3URL: http://www.farnell.com/cad/1551964.zip; ComponentLink3Description: http://www.farnell.com/cad/1551964.zip; Supplier 3: Mouser; Supplier Part Number 3: 71-CRCW0603-1.0K-E3; Stock 3: 615080; Pricing 3: 1=0.091, 10=0.040, 100=0.024, 500=0.019, 1000=0.016, 5000=0.005, 50000=0.004 (EUR); Product: Thick Film Resistors SMD; Series: CRCW; Standard Pack Qty: 5000
  R21-R24: Tolerance: 1%
R7 R9 R16 = CRES100R1%100P0603T_CRCW: Chip Resistor 0603 100R 1% 100ppm; Manufacturer: Vishay Dale; Sep: /; Prefix: CRES; Watt: 1/10; ppm: 100; Voltage: 75V; Man_PN: CRCW0603100RFKEA; Temperature Coefficient: ±100ppm/°C; TemperatureRange: -55°C ~ 155°C; TemperatureRange: - 55 C to + 155 C; RatedPower: 100 mW; Brand: Vishay / Dale; Tmp: 100R/1%/0603; Package: 0603; Supplier 1: Digi-Key; Supplier Part Number 1: 541-100HCT-ND; Category: Resistors; Stock 1: 473119; Pricing 1: 10=0.071, 50=0.0382, 200=0.02195, 1000=0.01497 (EUR); Supplier Device Package: 0603 (1608 Metric); Height: 0.020" (0.50mm); ComponentLink1URL: http://www.vishay.com/docs/20035/dcrcwe3.pdf; ComponentLink1Description: http://www.vishay.com/docs/20035/dcrcwe3.pdf; Supplier 2: Farnell; Supplier Part Number 2: 1469752; Stock 2: 22499; Pricing 2: 10=0.0162, 100=0.0134, 500=0.0115, 1000=0.009, 2500=0.0035 (EUR); ComponentLink2URL: http://www.farnell.com/datasheets/1720486.pdf; ComponentLink2Description: http://www.farnell.com/datasheets/1720486.pdf; ComponentLink3URL: http://www.farnell.com/cad/1551966.zip; ComponentLink3Description: http://www.farnell.com/cad/1551966.zip; Supplier 3: Mouser; Supplier Part Number 3: 71-CRCW0603-100-E3; Stock 3: 217023; Pricing 3: 1=0.091, 10=0.040, 100=0.024, 500=0.019, 1000=0.016, 5000=0.005, 50000=0.004 (EUR); Product: Thick Film Resistors SMD; Series: CRCW; Standard Pack Qty: 5000
R10 = CRES12K1%100P0603T_CRCW: Chip Resistor 0603 12K 1% 100ppm; Manufacturer: Vishay; Sep: /; Prefix: CRES; Watt: 1/10; ppm: 100; Voltage: 75V; TemperatureRange: -55°C ~ 155°C; Man_PN: CRCW060312K0FKEAC; Serie: CRCW; Tmp: 12K/1%/0603; Package: 0603; Mounting Type: SMD; Supplier 1: Digi-Key; Supplier Part Number 1: 541-4046-1-ND
R14 = CRES2.2K1%100P0402U_CRCW: Chip Resistor 0402 2.2K 1% 100ppm; Manufacturer: Vishay Dale; Sep: /; Prefix: CRES; Watt: 1/16; ppm: 100; Voltage: 50V; Man_PN: CRCW04022K20FKED; Temperature Coefficient: ±100ppm/°C; TemperatureRange: -55°C ~ 155°C; TemperatureRange: - 55 C to + 155 C; RatedPower: 63 mW; Brand: Vishay / Dale; Tmp: 2.2K/1%/0402; Package: 0402; Supplier 1: Digi-Key; Supplier Part Number 1: 541-2.20KLCT-ND; Category: Resistors; Stock 1: 176487; Pricing 1: 10=0.082, 50=0.044, 200=0.02525, 1000=0.01721 (EUR); Supplier Device Package: 0402 (1005 Metric); Height: 0.016" (0.40mm); ComponentLink1URL: http://www.vishay.com/docs/20035/dcrcwe3.pdf; ComponentLink1Description: http://www.vishay.com/docs/20035/dcrcwe3.pdf; Supplier 2: Farnell; Supplier Part Number 2: 1563902; Stock 2: 8892; Pricing 2: 1=0,004, 10=0,003 (EUR); ComponentLink2URL: http://www.farnell.com/cad/1551502.zip; ComponentLink2Description: http://www.farnell.com/cad/1551502.zip; Supplier 3: Mouser; Supplier Part Number 3: 71-CRCW0402-2.2K-E3; Stock 3: 83307; Pricing 3: 1=0.072, 10=0.040, 100=0.019, 1000=0.014, 10000=0.005, 30000=0.004, 50000=0.003 (EUR); Product: Thick Film Resistors SMD; Series: CRCW; Standard Pack Qty: 10000; ComponentLink3URL: http://www.mouser.com/ds/2/427/dcrcwe3-109170.pdf; ComponentLink3Description: http://www.mouser.com/ds/2/427/dcrcwe3-109170.pdf
TP1-TP3 = TP_TPH-1MM: Test Point, D=1mm (Foro 0.5mm), non montare; Value: TP d=1mm (foro 0.5mm); Populated: N.M.; Sep: /; Prefix: TP
TVS1-TVS3 = TVSP_WE-82356050560: Chip ESD suppressor bidirectional 5V 0603; Manufacturer: WE; Sep: /; Prefix: TVSP; Tmp: 82356050560; Man_PN: 82356050560; Package: 0603
U1 = IC_USBLC6-2P6: TVS 2 line, Low cap, 5V, SOT666; Manufacturer: STMicroelectronics; Sep: /; Prefix: IC; Voltage - Reverse Standoff (Typ): 5.25V; Voltage - Breakdown (Min): 6V; Voltage - Clamping (Max) @ Ipp: 17V; Current - Peak Pulse (10/1000µs): 5A (8/20µs); Power Line Protection: Yes; TemperatureRange: -40°C ~ 125°C (TJ); No. di Pin: 6; Tipo di Diodo: Unidirezionale, TVS; Breakdown Voltage: 6 V; Clamping Voltage: 17 V; Number of Channels: 2 Channel; Cd - Diode Capacitance: 3.5 pF; Tmp: USBLC6-2P6; Supplier 1: Digi-Key; Supplier Part Number 1: 497-5026-6-ND; RoHS: RoHS Compliant; Category: Circuit Protection; Stock 1: 12013; Pricing 1: 1=0.43, 10=0.29, 100=0.1916, 1000=0.14787 (EUR); Packaging: Digi-Reel®; Mounting Type: Surface Mount; Package: SOT-666, SOT-563; Supplier Device Package: SOT-666; ComponentLink1URL: http://www.st.com/web/en/resource/technical/document/datasheet/CD00050750.pdf; ComponentLink1Description: http://www.st.com/web/en/resource/technical/document/datasheet/CD00050750.pdf; Supplier 2: Farnell; Supplier Part Number 2: 1295310; Stock 2: 13729; Pricing 2: 5=0.342, 50=0.213, 250=0.198, 500=0.153, 1500=0.118 (EUR); ComponentLink2URL: http://www.farnell.com/datasheets/1690354.pdf; ComponentLink2Description: http://www.farnell.com/datasheets/1690354.pdf; Supplier 3: Mouser; Supplier Part Number 3: 511-USBLC6-2P6; Stock 3: 19592; Pricing 3: 1=0.443, 10=0.300, 100=0.198, 1000=0.153, 3000=0.129, 9000=0.125, 24000=0.120 (EUR); Termination Style: SMD/SMT; Brand: STMicroelectronics; Voltage: 5V; Product Category: Voltage Protection Devices; Standard Pack Qty: 3000; Minimum Order Quantity: 1; Reeling: True; ComponentLink3URL: http://www.mouser.com/ds/2/389/CD00050750-251785.pdf; ComponentLink3Description: http://www.mouser.com/ds/2/389/CD00050750-251785.pdf; Man_PN: USBLC6-2P6
U2 U3 U5 U8 U9 U11 = IC_M74VHC1GT125DT: IC BUFFER NON-INVERT 5.5V 5-TSOP; Manufacturer: ON Semiconductor; Sep: /; TemperatureRange: -55°C ~ 125°C (TA); Tmp: M74VHC1GT125DT1G; Prefix: IC; Mounting Type: SMD; Man_PN: M74VHC1GT125DT1G; Package: 5-TSOP; Supplier 1: Digi-Key; Supplier Part Number 1: M74VHC1GT125DT1GOSCT-ND
U4 = IC_FT232HL: IC HS USB TO UART/FIFO 48LQFP; Manufacturer: FTDI; Sep: /; TemperatureRange: -40°C ~ 85°C; Tmp: FT232HL; Prefix: IC; Mounting Type: SMD; Package: LQFP-48; Man_PN: FT232HL; Supplier 1: Digi-Key; Supplier Part Number 1: 768-1101-1-ND
U6 = IC_93LC56BT-I/OT: IC EEPROM 2K SPI 2MHz SOT23-6; Manufacturer: Microchip; Sep: /; TemperatureRange: -40°C ~ 85°C (TA); Tmp: 93LC56BT-I/OT; Prefix: IC; Mounting Type: SMD; Package: SOT23-6; Man_PN: 93LC56BT-I/OT; Supplier 1: Digi-Key; Supplier Part Number 1: 93LC56BT-I/OTCT-ND
U7 U10 = IC_74LVC1G02GV: IC GATE NOR 1CH 2-INP 5-TSOP; Manufacturer: NXP Semiconductors; Sep: /; TemperatureRange: -40°C to 125°C; Serie: LVC; Tmp: 74LVC1G02GV,125; Prefix: IC; Supplier 1: Digi-Key; Supplier Part Number 1: 568-4834-1-ND; Category: Integrated Circuits (ICs); Stock 1: 7994; Pricing 1: 1=0.38, 10=0.27, 25=0.21, 100=0.1591, 250=0.11244, 500=0.09004, 1000=0.06905 (EUR); Mounting Type: Surface Mount; Supplier Device Package: 5-TSOP; Package: SOT23-5, SC-74A, SOT-753; ComponentLink1URL: http://www.nxp.com/documents/data_sheet/74LVC1G02.pdf; ComponentLink1Description: http://www.nxp.com/documents/data_sheet/74LVC1G02.pdf; Supplier 2: Mouser; Supplier Part Number 2: 771-LVC1G02GV125; Stock 2: 3537; Pricing 2: 1=0.380, 10=0.217, 100=0.093, 1000=0.070, 3000=0.054, 9000=0.048, 24000=0.045, 45000=0.040, 99000=0.039 (EUR); Product: Single-Function Gate; Brand: NXP Semiconductors; Standard Pack Qty: 3000; ComponentLink2URL: http://www.mouser.com/ds/2/302/74LVC1G02-354492.pdf; ComponentLink2Description: http://www.mouser.com/ds/2/302/74LVC1G02-354492.pdf; Man_PN: 74LVC1G02GV,125
XT1 = XTAL_NX3225SA-12MHZ-STD-CSR-6: Xtal SMD 12MHz 8pF 25ppm (-40 to 85); Manufacturer: NDK; Sep: /; TemperatureRange: -40°C to 85°C; ESR: 100 Ohm; Tolerance: 25ppm; Supplier 1: Digi-Key; Supplier Part Number 1: 644-1180-1-ND; Man_PN: NX3225SA-12MHZ-STD-CSR-6; Category: Crystals and Oscillators; Stock 1: 17949; Pricing 1: 1=0.74, 10=0.656, 50=0.613, 100=0.5425, 500=0.51264, 1000=0.42856 (EUR); Mounting Type: Surface Mount; Package: 4-SMD, 3.2x2.5mm; ComponentLink1URL: http://www.ndk.com/images/products/catalog/c_NX3225SA-STD-CSR-6_e.pdf; ComponentLink1Description: http://www.ndk.com/images/products/catalog/c_NX3225SA-STD-CSR-6_e.pdf